# Altium schematic sheet FEU-102-1_part5.SchDoc: Делитель ФЭУ-82
size A3; Address1: (с) Быканов Андрей; Address2: г.Тула 2016г.; Revision: 1
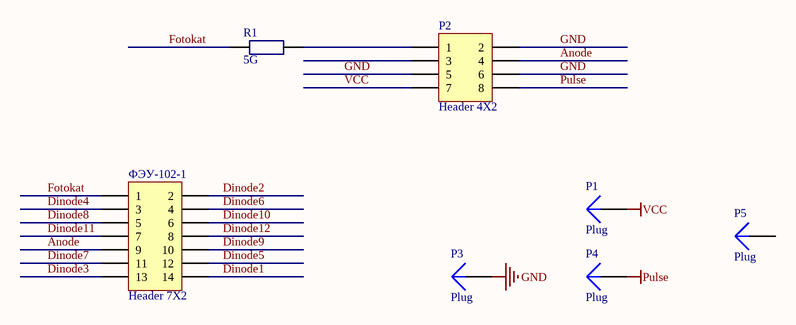
[diagram p0: FEU-102-1_part5.SchDoc]

## Parts
P1  Plug  [PIN1]
P2  Header 4X2  [HDR2X4]
P3  Plug  [PIN1]
P4  Plug  [PIN1]
P5  Plug  [PIN1]
R1  5G  [HVF2512T5007FE]
ФЭУ-102-1  Header 7X2  [ФЭУ-102]

## Nets
GND: P2.2 P2.5 P2.6 P3.1
Pulse: P2.8 P4.1
VCC: P1.1 P2.7
Anode: P2.4 ФЭУ-102-1.9
Dinode1: ФЭУ-102-1.14
Dinode2: ФЭУ-102-1.2
Dinode3: ФЭУ-102-1.13
Dinode4: ФЭУ-102-1.3
Dinode5: ФЭУ-102-1.12
Dinode6: ФЭУ-102-1.4
Dinode7: ФЭУ-102-1.11
Dinode8: ФЭУ-102-1.5
Dinode9: ФЭУ-102-1.10
Dinode10: ФЭУ-102-1.6
Dinode11: ФЭУ-102-1.7
Dinode12: ФЭУ-102-1.8
Fotokat: R1.1(A) ФЭУ-102-1.1
NetP2_1: P2.1 R1.2

Not connected (* = marked no-connect by the designer): P2 3; P5 1

## Notes on the sheet
- Title
- Size:
- Date:
- A3
- Number:
- Time:
- Revision:
- Sheet
- of
- File:

## Library data of the parts
P2 = Header 4X2: Header, 4-Pin, Dual row; LatestRevisionDate: 17-Jul-2002; LatestRevisionNote: Re-released for DXP Platform.; Publisher: Altium Limited
R1 = Resistor 0805: Order: HVF2512T5007FE; Value: 5G
ФЭУ-102-1 = Header 7X2: Header, 7-Pin, Dual row; LatestRevisionDate: 17-Jul-2002; LatestRevisionNote: Re-released for DXP Platform.; Publisher: Altium Limited
P1 P3-P5 = Plug: LatestRevisionDate: 17-Jul-2002; LatestRevisionNote: Re-released for DXP Platform.; Publisher: Altium Limited